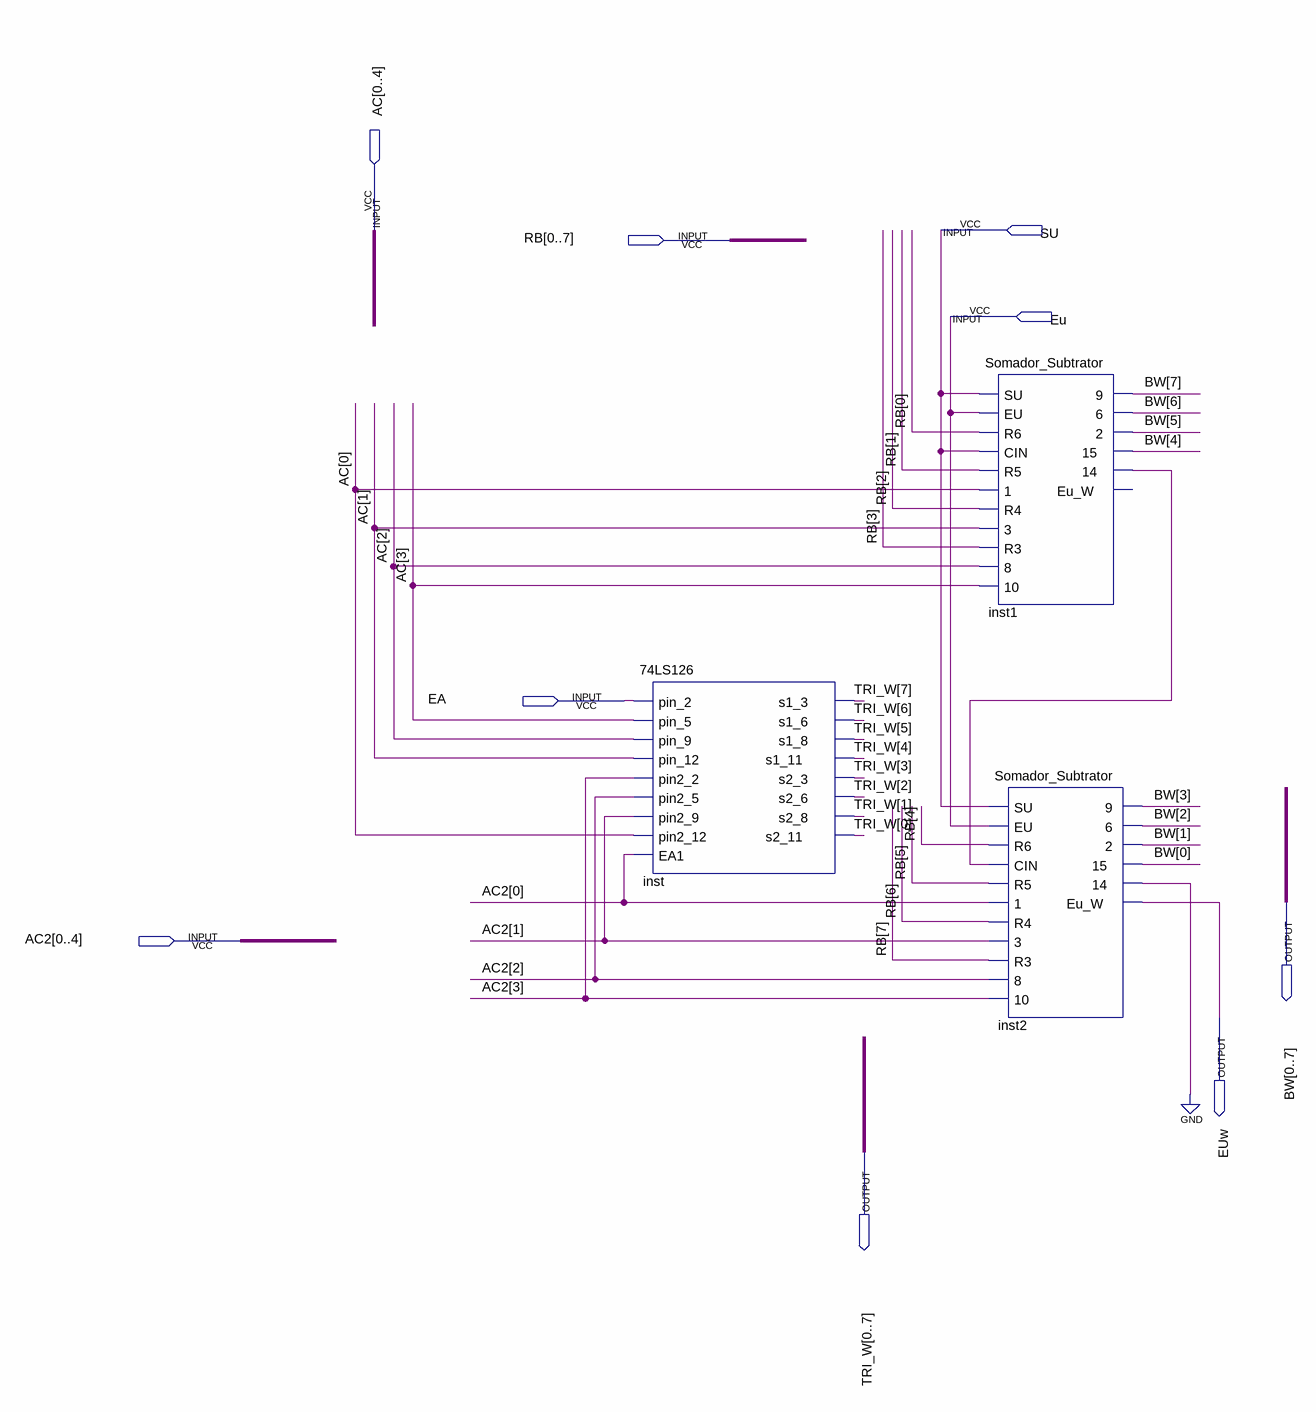
[diagram p0: schematic sheet]
// Quartus schematic Adder_Subtractor_com_74LS126.bdf as structural Verilog: 3 symbols, 9 pins
module Adder_Subtractor_com_74LS126 (
  input  [0:4] AC,
  input  SU,
  input  [0:7] RB,
  input  Eu,
  input  EA,
  input  [0:4] AC2,
  output [0:7] BW,
  output EUw,
  output [0:7] TRI_W
);

  wire inst1_14, inst2_14;

  \74LS126  inst (
    .pin_2(EA), .pin_5(AC[3]), .pin_9(AC[2]), .pin_12(AC[1]), .pin2_2(AC2[3]), .pin2_5(AC2[2]),
    .pin2_9(AC2[1]), .pin2_12(AC[0]), .EA1(AC2[0]), .s1_3(TRI_W[7]), .s1_6(TRI_W[6]), .s1_8(TRI_W[5]),
    .s1_11(TRI_W[4]), .s2_3(TRI_W[3]), .s2_6(TRI_W[2]), .s2_8(TRI_W[1]), .s2_11(TRI_W[0]));
  Somador_Subtrator inst1 (
    .SU(SU), .EU(Eu), .R6(RB[0]), .CIN(SU), .R5(RB[1]), .\1 (AC[0]), .R4(RB[2]), .\3 (AC[1]), .R3(RB[3]),
    .\8 (AC[2]), .\10 (AC[3]), .\9 (BW[7]), .\6 (BW[6]), .\2 (BW[5]), .\15 (BW[4]), .\14 (inst1_14));  // open: Eu_W
  Somador_Subtrator inst2 (
    .SU(SU), .EU(Eu), .R6(RB[4]), .CIN(inst1_14), .R5(RB[5]), .\1 (AC2[0]), .R4(RB[6]), .\3 (AC2[1]),
    .R3(RB[7]), .\8 (AC2[2]), .\10 (AC2[3]), .\9 (BW[3]), .\6 (BW[2]), .\2 (BW[1]), .\15 (BW[0]),
    .\14 (inst2_14), .Eu_W(EUw));
  // also tied to GND on the sheet: inst2_14
endmodule
